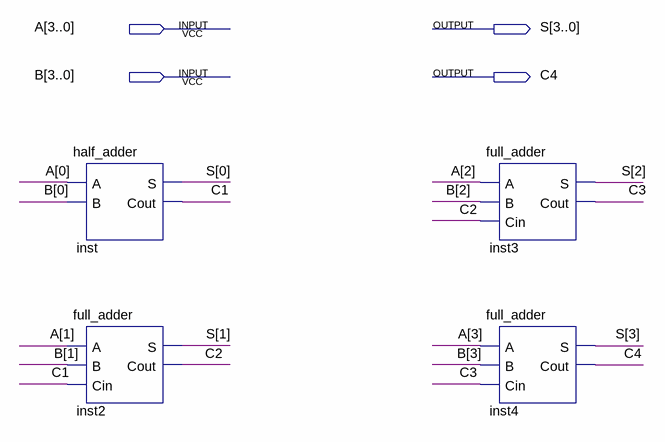
[diagram p0: schematic sheet]
// Quartus schematic LAB01.bdf as structural Verilog: 4 symbols, 4 pins
module LAB01 (
  input  [3:0] A,
  input  [3:0] B,
  output [3:0] S,
  output C4
);

  wire C1, C2, C3;

  half_adder inst (.A(A[0]), .B(B[0]), .S(S[0]), .Cout(C1));
  full_adder inst2 (.A(A[1]), .B(B[1]), .Cin(C1), .S(S[1]), .Cout(C2));
  full_adder inst3 (.A(A[2]), .B(B[2]), .Cin(C2), .S(S[2]), .Cout(C3));
  full_adder inst4 (.A(A[3]), .B(B[3]), .Cin(C3), .S(S[3]), .Cout(C4));
endmodule
